# Altium project ov5640.PrjPcb
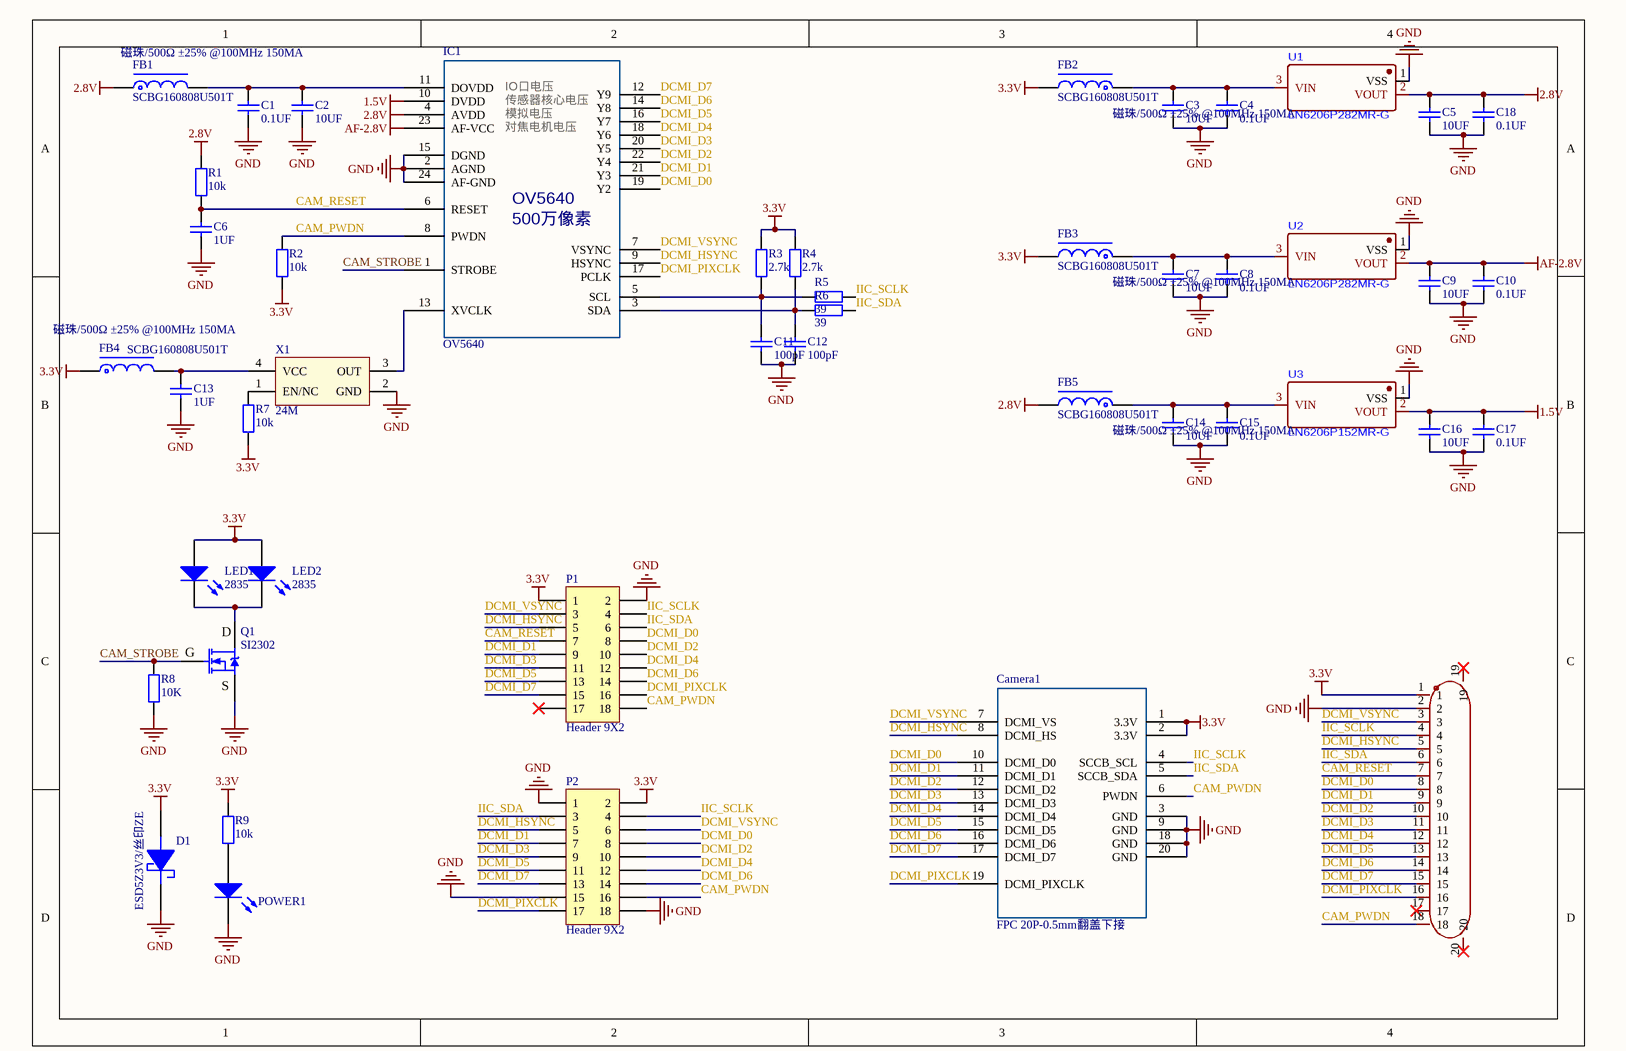
[diagram p0: Sheet1.SchDoc]
1 sheet, 46 parts. Net scope: global (net labels, ports and power ports of the same name join across sheets).
Board file: PCB1.PcbDoc

## Sheet Sheet1.SchDoc
size A4; SheetNumber: 1; SheetTotal: 1

### Parts
C1  0.1UF  [C0603_L]
C2  10UF  [C0603_L]
C3  10UF  [C0603_L]
C4  0.1UF  [C0603_L]
C5  10UF  [C0603_L]
C6  1UF  [C0603_L]
C7  10UF  [C0603_L]
C8  0.1UF  [C0603_L]
C9  10UF  [C0603_L]
C10  0.1UF  [C0603_L]
C11  100pF  [C0603_L]
C12  100pF  [C0603_L]
C13  1UF  [C0603_L]
C14  10UF  [C0603_L]
C15  0.1UF  [C0603_L]
C16  10UF  [C0603_L]
C17  0.1UF  [C0603_L]
C18  0.1UF  [C0603_L]
Camera1  FPC 20P-0.5mm翻盖下接  [FPC20P-0.5MM]
D1  ESD5Z3V3/丝印ZE  [SOD523]
FB1  SCBG160808U501T  [FB0603]
FB2  SCBG160808U501T  [FB0603]
FB3  SCBG160808U501T  [FB0603]
FB4  SCBG160808U501T  [FB0603]
FB5  SCBG160808U501T  [FB0603]
IC1  OV5640  [OV2640]
LED1  2835  [LED 2835-2P]
LED2  2835  [LED 2835-2P]
P1  Header 9X2  [HDR2X9]
P2  Header 9X2  [HDR2X9]
POWER1  LED  [D0603]  (value not drawn)
Q1  SI2302  [SOT23-3N]
R1  10k  [R0603_L]
R2  10k  [R0603_L]
R3  2.7k  [R0603_L]
R4  2.7k  [R0603_L]
R5  39  [R0603_L]
R6  39  [R0603_L]
R7  10k  [R0603_L]
R8  10K  [R0603_L]
R9  10k  [R0603_L]
U1  LN6206P282MR-G  [SOT-23-3_L2.9-W1.3-P1.90-LS2.4-BR]
U2  LN6206P282MR-G  [SOT-23-3_L2.9-W1.3-P1.90-LS2.4-BR]
U3  LN6206P152MR-G  [SOT-23-3_L2.9-W1.3-P1.90-LS2.4-BR]
X1  24M  [OSC-3225-4P]
X2  AFC07-S18ECA-00  [FPC-SMD_AFC07-S18ECA-00]  (value not drawn)

### Nets
1.5V: C16.2 C17.2 IC1.10(DVDD) U3.2(VOUT)
2.8V: C5.2 C18.2 FB1.1 FB5.2 IC1.4(AVDD) R1.1 U1.2(VOUT)
3.3V: Camera1.1(3.3V) Camera1.2(3.3V) D1.1(+) FB2.2 FB3.2 FB4.1 LED1.1(A) LED2.1(A) P1.1 P2.2 R2.2 R3.2 R4.2 R7.2 R9.2 X2.1
AF-2.8V: C9.2 C10.2 IC1.23(AF-VCC) U2.2(VOUT)
GND: C1.1 C2.1 C3.1 C4.1 C5.1 C6.1 C7.1 C8.1 C9.1 C10.1 C11.1 C12.1 C13.1 C14.1 C15.1 C16.1 C17.1 C18.1 Camera1.3(GND) Camera1.9(GND) Camera1.18(GND) Camera1.20(GND) D1.2(-) IC1.2(AGND) IC1.15(DGND) IC1.24(AF-GND) P1.2 P2.1 P2.15 P2.18 POWER1.2(K) Q1.2(S) R8.1 U1.1(VSS) U2.1(VSS) U3.1(VSS) X1.2(GND) X2.2
CAM_PWDN: Camera1.6(PWDN) IC1.8(PWDN) P1.18 P2.16 R2.1 X2.18
CAM_RESET: C6.2 IC1.6(RESET) P1.7 R1.2 X2.7
CAM_STROBE: IC1.1(STROBE) Q1.1(G) R8.2
DCMI_D0: Camera1.10(DCMI_D0) IC1.19(Y2) P1.8 P2.8 X2.8
DCMI_D1: Camera1.11(DCMI_D1) IC1.21(Y3) P1.9 P2.7 X2.9
DCMI_D2: Camera1.12(DCMI_D2) IC1.22(Y4) P1.10 P2.10 X2.10
DCMI_D3: Camera1.13(DCMI_D3) IC1.20(Y5) P1.11 P2.9 X2.11
DCMI_D4: Camera1.14(DCMI_D4) IC1.18(Y6) P1.12 P2.12 X2.12
DCMI_D5: Camera1.15(DCMI_D5) IC1.16(Y7) P1.13 P2.11 X2.13
DCMI_D6: Camera1.16(DCMI_D6) IC1.14(Y8) P1.14 P2.14 X2.14
DCMI_D7: Camera1.17(DCMI_D7) IC1.12(Y9) P1.15 P2.13 X2.15
DCMI_HSYNC: Camera1.8(DCMI_HS) IC1.9(HSYNC) P1.5 P2.5 X2.5
DCMI_PIXCLK: Camera1.19(DCMI_PIXCLK) IC1.17(PCLK) P1.16 P2.17 X2.16
DCMI_VSYNC: Camera1.7(DCMI_VS) IC1.7(VSYNC) P1.3 P2.6 X2.3
IIC_SCLK: Camera1.4(SCCB_SCL) P1.4 P2.4 R5.2 X2.4
IIC_SDA: Camera1.5(SCCB_SDA) P1.6 P2.3 R6.2 X2.6
NetC1_2: C1.2 C2.2 FB1.2 IC1.11(DOVDD)
NetC3_2: C3.2 C4.2 FB2.1 U1.3(VIN)
NetC7_2: C7.2 C8.2 FB3.1 U2.3(VIN)
NetC11_2: C11.2 IC1.5(SCL) R3.1 R5.1
NetC12_2: C12.2 IC1.3(SDA) R4.1 R6.1
NetC13_2: C13.2 FB4.2 X1.4(VCC)
NetC14_2: C14.2 C15.2 FB5.1 U3.3(VIN)
NetIC1_13: IC1.13(XVCLK) X1.3(OUT)
NetLED1_2: LED1.2(K) LED2.2(K) Q1.3(D)
NetPOWER1_1: POWER1.1(A) R9.1
NetR7_1: R7.1 X1.1(EN/NC)

Not connected (* = marked no-connect by the designer): P1 17*; X2 17* 19* 20*

### Notes on the sheet
- 磁珠/500Ω ±25% @100MHz 150MA
- (near FB2) 磁珠/500Ω ±25% @100MHz 150MA
- (near FB3) 磁珠/500Ω ±25% @100MHz 150MA
- (near FB5) 磁珠/500Ω ±25% @100MHz 150MA
- (in symbol OV5640) IO口电压; 传感器核心电压; 模拟电压; 对焦电机电压; 500万像素

### Library data of the parts
C1-C18 = C: 贴片电容/MLCC电容
Camera1 = FK_Camera
D1 = TVS
FB1-FB5 = FB: 贴片磁珠
LED1 LED2 = LED-2835: 0.2W 功率LED
P1 P2 = Header 9X2: Header, 9-Pin, Dual row
Q1 = SI2302: N沟道 20V/3A
R1-R9 = R: 贴片电阻
U3 = LN6206P282MR-G
X1 = XTAL-ACT-4P: 4脚有源晶振(振荡器)